# EAGLE design uc_board (EAGLE 6.4)
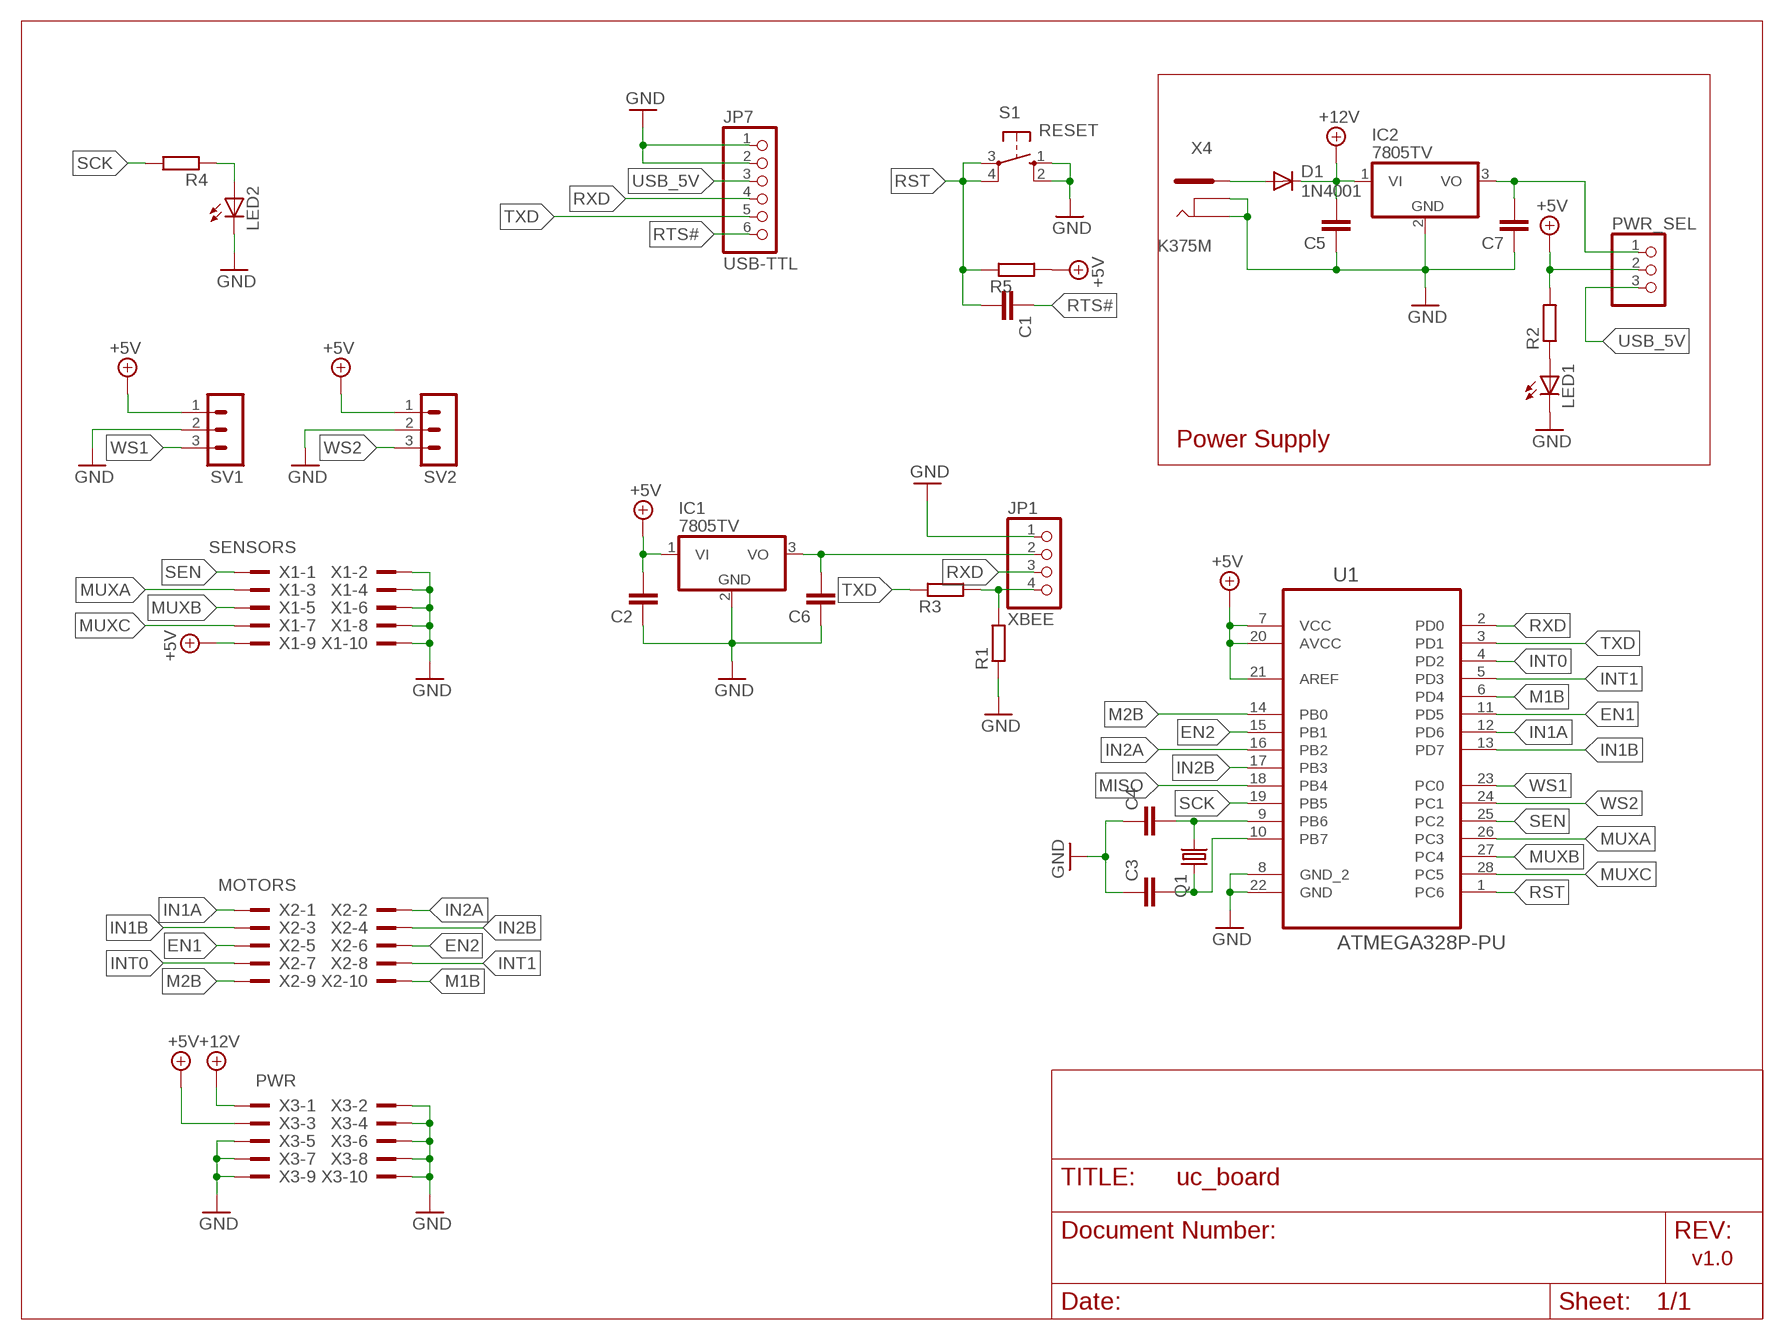
[diagram p0: schematic, sheet 1]

## Parts
C1  C-EU050-025X075  [C050-025X075]
C2  C-EU025-050X050  [C025-050X050]
C3  C-EU050-024X044  [C050-024X044]
C4  C-EU050-024X044  [C050-024X044]
C5  C-EU025-050X050  [C025-050X050]
C6  C-EU025-050X050  [C025-050X050]
C7  C-EU025-050X050  [C025-050X050]
D1  1N4001  1N4004  [DO41-10]
IC1  7805TV  [TO220V]
IC2  7805TV  [TO220V]
JP1  XBEE  PINHD-1X4/90  [1X04/90]
JP7  USB-TTL  PINHD-1X6/90  [1X06/90]
LED1  LED5MM  [LED5MM]
LED2  LED5MM  [LED5MM]
PWR_SEL  PINHD-1X3  [1X03]
Q1  CRYSTALHC49S  [HC49/S]
R1  R-EU_0207/10  [0207/10]
R2  R-EU_0207/10  [0207/10]
R3  R-EU_0207/10  [0207/10]
R4  R-EU_0207/10  [0207/10]
R5  R-EU_0207/10  [0207/10]
S1  RESET  10-XX  [B3F-10XX]
SV1  MA03-1  [MA03-1]
SV2  MA03-1  [MA03-1]
U1  ATMEGA328P-PU  [DIP254P762X457-28]
X1  SENSORS  2510-  [PAK100/2500-10]
X2  MOTORS  2510-  [PAK100/2500-10]
X3  PWR  2510-  [PAK100/2500-10]
X4  K375M  [K375M]

## Nets
+5V: C2.2 IC1.1(VI) PWR_SEL.2 R2.2 R5.2 SV1.1 SV2.1 U1.7(VCC) U1.20(AVCC) U1.21(AREF) X1.9 X3.3
+12V: C5.2 D1.C IC2.1(VI) X3.1
EN1: U1.11(PD5) X2.5
EN2: U1.15(PB1) X2.6
GND: C2.1 C3.1 C4.1 C5.1 C6.1 C7.1 IC1.2(GND) IC2.2(GND) JP1.1 JP7.1 JP7.2 LED1.K(C) LED2.K(C) R1.1 S1.1(S) S1.2(S1) SV1.2 SV2.2 U1.8(GND_2) U1.22(GND) X1.2 X1.4 X1.6 X1.8 X1.10 X3.2 X3.4 X3.5 X3.6 X3.7 X3.8 X3.9 X3.10 X4.2 X4.3
IN1A: U1.12(PD6) X2.1
IN1B: U1.13(PD7) X2.3
IN2A: U1.16(PB2) X2.2
IN2B: U1.17(PB3) X2.4
INT0: U1.4(PD2) X2.7
INT1: U1.5(PD3) X2.8
M1B: U1.6(PD4) X2.10
M2B: U1.14(PB0) X2.9
MISO: U1.18(PB4)
MUXA: U1.26(PC3) X1.3
MUXB: U1.27(PC4) X1.5
MUXC: U1.28(PC5) X1.7
N$1: C4.2 Q1.1 U1.9(PB6)
N$2: C3.2 Q1.2 U1.10(PB7)
N$3: LED1.A R2.1
N$4: LED2.A R4.1
N$5: C6.2 IC1.3(VO) JP1.2
N$6: JP1.4 R1.2 R3.2
N$17: D1.A X4.1
N$22: C7.2 IC2.3(VO) PWR_SEL.1
RST: C1.2 R5.1 S1.3(P) S1.4(P1) U1.1(PC6)
RTS#: C1.1 JP7.6
RXD: JP1.3 JP7.4 U1.2(PD0)
SCK: R4.2 U1.19(PB5)
SEN: U1.25(PC2) X1.1
TXD: JP7.5 R3.1 U1.3(PD1)
USB_5V: JP7.3 PWR_SEL.3
WS1: SV1.3 U1.23(PC0)
WS2: SV2.3 U1.24(PC1)

## Notes on the sheet
- Power Supply
- v1.0

## Library data of the parts
C1-C7 = rcl:C-EU: CAPACITOR, European symbol
D1 = minimidi:1N4004: DIODE general purpose rectifier, 1 A
IC1 IC2 = linear:78*: Positive VOLTAGE REGULATOR Source: http://cache.national.com/ds/LM/LM78L05.pdf http://www.fairchildsemi.com/ds/LM/LM7805.pdf
JP1 = pinhead:PINHD-1X4: PIN HEADER
JP7 = pinhead:PINHD-1X6: PIN HEADER
LED1 LED2 = led:LED: LED OSRAM: - CHIPLED LG R971, LG N971, LY N971, LG Q971, LY Q971, LO R971, LY R971 LH N974, LH R974 LS Q976, LO Q976, LY Q976 LO Q996 - Hyper CHIPLED LW Q18S LB Q993, LB Q99A, LB R99A - SideLED LS A670, LO A670, LY A670, LG A670, LP A670 LB A673, LV A673, LT A673, LW A673 LH A674 LY A675 LS A676, LA A676, LO A676, LY A676, LW A676 LS A679, LY A679, LG A679 - Hyper Micro SIDELED® LS Y876, LA Y876, LO Y876, LY Y876 LT Y87S - SmartLED LW L88C, LW L88S LB L89C, LB L89S, LG L890 LS L89K, LO L89K, LY L89K LS L896, LA L896, LO L896, LY L896 - TOPLED LS T670, LO T670, LY T670, LG T670, LP T670 LSG T670, LSP T670, LSY T670, LOP T670, LYG T670 LG T671, LOG T671, LSG T671 LB T673, LV T673, LT T673, LW T673 LH T674 LS T676, LA T676, LO T676, LY T676, LB T676, LH T676, LSB T676, LW T676 LB T67C, LV T67C, LT T67C, LS T67K, LO T67K, LY T67K, LW E67C LS E67B, LA E67B, LO E67B, LY E67B, LB E67C, LV E67C, LT E67C LW T67C LS T679, LY T679, LG T679 LS T770, LO T770, LY T770, LG T770, LP T770 LB T773, LV T773, LT T773, LW T773 LH T774 LS E675, LA E675, LY E675, LS T675 LS T776, LA T776, LO T776, LY T776, LB T776 LHGB T686 LT T68C, LB T68C - Hyper Mini TOPLED® LB M676 - Mini TOPLED Santana® LG M470 LS M47K, LO M47K, LY M47K Source: http://www.osram.convergy.de LUXEON: - LUMILED® LXK2-PW12-R00, LXK2-PW12-S00, LXK2-PW14-U00, LXK2-PW14-V00 LXK2-PM12-R00, LXK2-PM12-S00, LXK2-PM14-U00 LXK2-PE12-Q00, LXK2-PE12-R00, LXK2-PE12-S00, LXK2-PE14-T00, LXK2-PE14-U00 LXK2-PB12-K00, LXK2-PB12-L00, LXK2-PB12-M00, LXK2-PB14-N00, LXK2-PB14-P00, LXK2-PB14-Q00 LXK2-PR12-L00, LXK2-PR12-M00, LXK2-PR14-Q00, LXK2-PR14-R00 LXK2-PD12-Q00, LXK2-PD12-R00, LXK2-PD12-S00 LXK2-PH12-R00, LXK2-PH12-S00 LXK2-PL12-P00, LXK2-PL12-Q00, LXK2-PL12-R00 Source: www.luxeon.com KINGBRIGHT: KA-3528ASYC Source: www.kingbright.com
PWR_SEL = pinhead:PINHD-1X3: PIN HEADER
Q1 = crystal:CRYSTAL: CRYSTAL; OC_FARNELL: 1667008; OC_NEWARK: unknown
R1-R5 = resistor:R-EU_: RESISTOR, European symbol
S1 = switch-omron:10-XX: OMRON SWITCH; MPN: B3F-1000; OC_FARNELL: 176432; OC_NEWARK: 36M3542
SV1 SV2 = con-lstb:MA03-1: PIN HEADER; OC_FARNELL: unknown; OC_NEWARK: unknown
U1 = atmel2:ATMEGA328P-PU: 8-bit Microcontroller with In-System Programmable Flash; MPN: ATMEGA328P-PU; OC_FARNELL: 1715487; OC_NEWARK: 15R0268; PACKAGE: PDIP-28; SUPPLIER: Atmel
X1-X3 = con-3m:2510-: 3M (TM) Pak 100 4-Wall Header Source: 3M; MF: 3M; MPN: 2510-6002UB; OC_FARNELL: 9838244; OC_NEWARK: 46F4725
X4 = con-shallin:K375M: K375M - DC POWER JACK 2.5mm/CENTRAL PIN Source: Data sheet <http://www.shallin.com/productview.aspx?itemnumber=K375M>

## Board
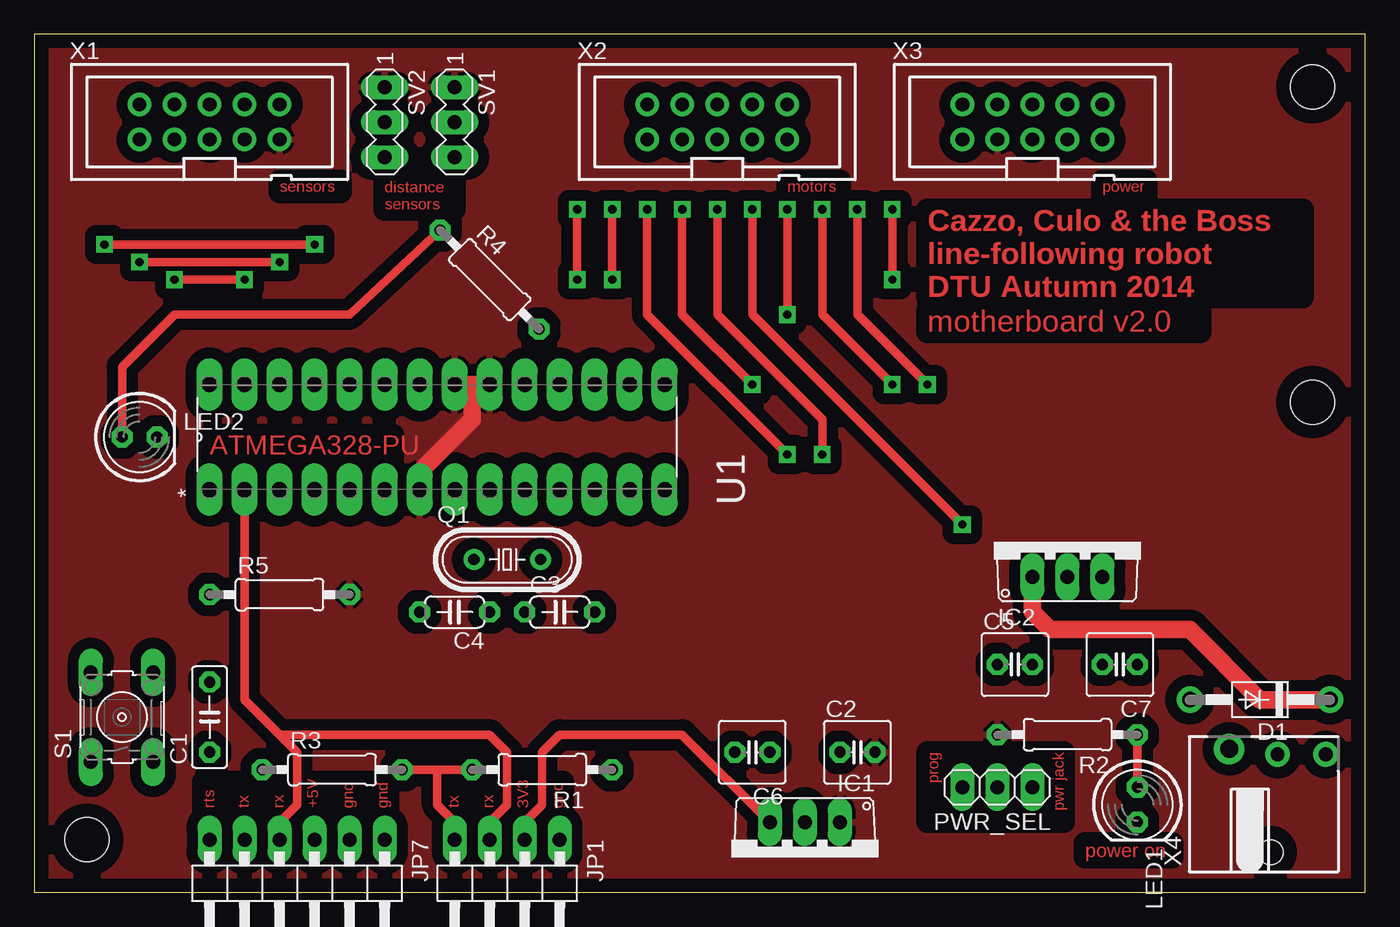
[diagram p1: board, top side]
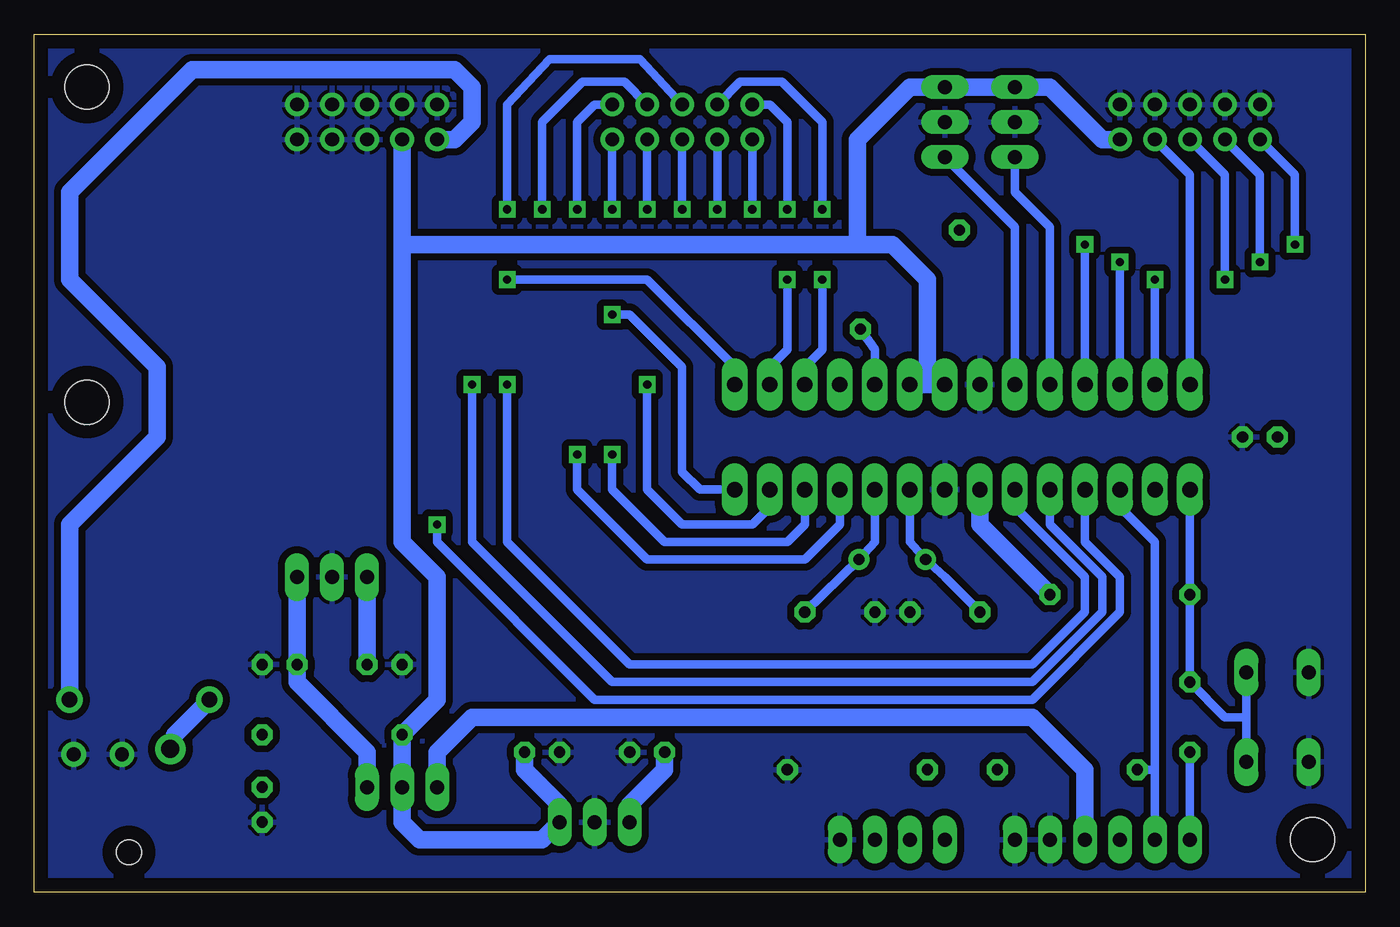
[diagram p2: board, bottom side, seen from below]

Size 96.52 x 62.23 mm. Coordinates in mm from the lower left corner, seen from the top.
Outline: 0,0 96.52,0 96.52,62.23 0,62.23 0,0
Copper layers (1*16): Top 0.035mm / dielectric 1.5mm / Bottom 0.035mm
Design rules "default *": minimum track width 8mil, minimum drill 24mil, track to track 8mil, track to pad 8mil, pad to pad 8mil, via to via 8mil, smd to smd 8mil, copper to edge 40mil, drill to drill 8mil, minimum pad ring 14mil, minimum via ring 12mil, stop-mask expansion 4mil, vias tented up to drill 0mil, thermal gap 10mil
Holes 3.2 mm at 92.71,58.42 3.81,3.81 92.71,35.56

### Footprints (pad centres in the part's own frame; a part is rotated, then mirrored left to right if it is on the bottom)
C050-025X075 = drill 0.813 octagon: 1 -2.54,0; 2 2.54,0
C025-050X050 = drill 0.813 octagon: 1 -1.27,0; 2 1.27,0
C050-024X044 = drill 0.813 octagon: 1 -2.54,0; 2 2.54,0
DO41-10 = drill 1.118 pad 1.93: A 5.08,0; C -5.08,0
TO220V = drill 1.016 long: 1 -2.54,-2.54; 2 0,-2.54; 3 2.54,-2.54
1X04/90 = drill 1.016 long: 1 -3.81,-3.81; 2 -1.27,-3.81; 3 1.27,-3.81; 4 3.81,-3.81
1X06/90 = drill 1.016 long: 1 -6.35,-3.81; 2 -3.81,-3.81; 3 -1.27,-3.81; 4 1.27,-3.81; 5 3.81,-3.81; 6 6.35,-3.81
LED5MM = drill 0.813 octagon: A -1.27,0; K 1.27,0
1X03 = drill 1.016 long: 1 -2.54,0; 2 0,0; 3 2.54,0
HC49/S = drill 0.813: 1 -2.413,0; 2 2.413,0
0207/10 = drill 0.813 octagon: 1 -5.08,0; 2 5.08,0
B3F-10XX = drill 1.016 long: 1 -3.251,2.261; 2 3.251,2.261; 3 -3.251,-2.261; 4 3.251,-2.261
MA03-1 = drill 1.016 long: 1 -2.54,0; 2 0,0; 3 2.54,0
DIP254P762X457-28 = drill 1.118 long: 1 -7.62,33.02; 2 -7.62,30.48; 3 -7.62,27.94; 4 -7.62,25.4; 5 -7.62,22.86; 6 -7.62,20.32; 7 -7.62,17.78; 8 -7.62,15.24; 9 -7.62,12.7; 10 -7.62,10.16; 11 -7.62,7.62; 12 -7.62,5.08; 13 -7.62,2.54; 14 -7.62,0; 15 0,0; 16 0,2.54; 17 0,5.08; 18 0,7.62; 19 0,10.16; 20 0,12.7; 21 0,15.24; 22 0,17.78; 23 0,20.32; 24 0,22.86; 25 0,25.4; 26 0,27.94; 27 0,30.48; 28 0,33.02
PAK100/2500-10 = drill 1 pad 1.422: 1 -5.08,-1.27; 2 -5.08,1.27; 3 -2.54,-1.27; 4 -2.54,1.27; 5 0,-1.27; 6 0,1.27; 7 2.54,-1.27; 8 2.54,1.27; 9 5.08,-1.27; 10 5.08,1.27
K375M = drill 1.3 pad 2.184: 1 -3.5,1.5 | drill 1 pad 1.8: 2 3.5,1.1; 3 0,1.1 | hole 1.8: -0.5,-6

### Placement (x,y rotation side)
C1  12.7,12.7 90 top
C2  59.69,10.16 0 top
C3  38.1,20.32 0 top
C4  30.48,20.32 180 top
C5  71.12,16.51 0 top
C6  52.07,10.16 180 top
C7  78.74,16.51 180 top
D1  88.9,13.97 180 top
IC1  55.88,2.54 180 top
IC2  74.93,25.4 0 top
JP1  34.29,0 180 top
JP7  19.05,0 180 top
LED1  80.01,6.35 270 top
LED2  7.62,33.02 0 top
PWR_SEL  69.85,7.62 180 top
Q1  34.29,24.13 0 top
R1  36.83,8.89 180 top
R2  74.93,11.43 180 top
R3  21.59,8.89 0 top
R4  33.02,44.45 315 top
R5  17.78,21.59 0 top
S1  6.35,12.7 90 top
SV1  30.48,55.88 270 top
SV2  25.4,55.88 270 top
U1  45.72,36.83 90 top
X1  12.7,55.88 0 top
X2  49.53,55.88 0 top
X3  72.39,55.88 0 top
X4  90.17,8.89 0 top

### Tracks (layer width: path | path; a pad name or v marks a point on that pad's centre or on a via)
+5V
  Top 1.27: U1.7 27.94,30.48 31.75,34.29 31.75,36.83 | 31.75,36.83 U1.20 | U1.21 31.75,36.83
  Bottom 1.27: C2.2 60.96,8.89 58.42,6.35 IC1.1 59.69,3.81 68.58,3.81 69.85,5.08 PWR_SEL.2 R2.2 67.31,13.97 67.31,22.86 69.85,25.4 69.85,46.99 | 69.85,46.99 X3.3 | U1.21 31.75,36.83 | 31.75,36.83 U1.20 | 69.85,46.99 36.83,46.99 | 36.83,46.99 34.29,46.99 31.75,44.45 31.75,36.83 | 36.83,46.99 36.83,54.61 33.02,58.42 SV1.1 SV2.1 22.86,58.42 19.05,54.61 X1.9 | U1.7 27.94,26.67 R5.2
  pour Top (isolate 0.813): 0,62.23 96.52,62.23 96.52,0 0,0
+12V
  Top 1.27: IC2.1 72.39,20.32 73.66,19.05 83.82,19.05 88.9,13.97 D1.C
  Bottom 1.27: C5.2 IC2.1 | D1.C 93.98,26.67 87.63,33.02 87.63,38.1 93.98,44.45 93.98,50.8 85.09,59.69 66.04,59.69 64.77,58.42 64.77,55.88 66.04,54.61 X3.1
EN1  (via drill 0.6)
  Top 0.61: v49.53,49.53 49.53,41.91 57.15,34.29 v57.15,31.75
  Bottom 0.61: U1.11 38.1,26.67 40.64,24.13 52.07,24.13 57.15,29.21 v57.15,31.75 | X2.5 v49.53,49.53
EN2  (via drill 0.6)
  Top 0.61: v62.23,44.45 v62.23,49.53
  Bottom 0.61: X2.6 52.6,60.43 59.16,60.43 62.23,57.15 v62.23,49.53 | U1.15 45.72,38.1 52.07,44.45 v62.23,44.45
GND
  pour Bottom (isolate 0.508): 0,62.23 96.52,62.23 96.52,0 0,0
IN1A  (via drill 0.6)
  Top 0.61: v44.45,49.53 44.45,41.91 v54.61,31.75
  Bottom 0.61: U1.12 40.64,26.67 41.91,25.4 50.8,25.4 54.61,29.21 v54.61,31.75 | X2.1 v44.45,49.53
IN1B  (via drill 0.6)
  Top 0.61: v46.99,49.53 46.99,41.91 v52.07,36.83
  Bottom 0.61: U1.13 43.18,27.94 44.45,26.67 49.53,26.67 52.07,29.21 v52.07,36.83 | X2.3 v46.99,49.53
IN2A  (via drill 0.6)
  Top 0.61: v41.91,49.53 v41.91,44.45
  Bottom 0.61: X2.2 43.18,57.15 41.91,55.88 v41.91,49.53 | v41.91,44.45 41.91,39.37 43.18,38.1 U1.16
IN2B  (via drill 0.6)
  Top 0.61: v39.37,44.45 v39.37,49.53
  Bottom 0.61: X2.4 45.35,58.79 42.28,58.79 39.37,55.88 v39.37,49.53 | U1.17 40.64,38.1 39.37,39.37 v39.37,44.45
INT0  (via drill 0.6)
  Top 0.61: v52.07,49.53 52.07,41.91 v67.31,26.67
  Bottom 0.61: U1.4 20.32,25.4 17.78,22.86 17.78,20.32 24.13,13.97 55.88,13.97 67.31,25.4 v67.31,26.67 | X2.7 v52.07,49.53
INT1  (via drill 0.6)
  Top 0.61: v59.69,49.53 59.69,41.91 v64.77,36.83
  Bottom 0.61: U1.5 22.86,26.67 19.05,22.86 19.05,20.32 24.13,15.24 54.61,15.24 64.77,25.4 v64.77,36.83 | X2.8 53.71,58.79 56.78,58.79 59.69,55.88 v59.69,49.53
M1B  (via drill 0.6)
  Top 0.61: v57.15,49.53 57.15,41.91 v62.23,36.83
  Bottom 0.61: U1.6 25.4,27.94 20.32,22.86 20.32,20.32 24.13,16.51 53.34,16.51 62.23,25.4 v62.23,36.83 | X2.10 55.88,57.15 57.15,55.88 v57.15,49.53
M2B  (via drill 0.6)
  Top 0.61: v54.61,49.53 v54.61,41.91
  Bottom 0.61: U1.14 48.26,29.21 49.53,30.48 49.53,38.1 53.34,41.91 v54.61,41.91 | X2.9 v54.61,49.53
MUXA  (via drill 0.6)
  Top 0.61: v17.78,45.72 v7.62,45.72
  Bottom 0.61: X1.3 7.62,52.07 v7.62,45.72 | U1.26 v17.78,45.72
MUXB  (via drill 0.6)
  Top 0.61: v15.24,44.45 v10.16,44.45
  Bottom 0.61: X1.5 10.16,52.07 v10.16,44.45 | U1.27 v15.24,44.45
MUXC
  Bottom 0.61: X1.7 12.7,52.07 U1.28
N$1
  Bottom 0.61: U1.9 33.02,25.4 Q1.1 30.48,22.86 C4.2
N$2
  Bottom 0.61: U1.10 35.56,25.4 Q1.2 C3.2
N$3
  Top 0.61: R2.1 LED1.A
N$4
  Top 0.61: R4.1 22.86,41.91 10.16,41.91 6.35,38.1 LED2.A
N$5
  Top 0.61: JP1.2 35.56,5.08 36.83,6.35 36.83,10.16 38.1,11.43 46.99,11.43 IC1.3
  Bottom 1.27: C6.2 50.8,8.89 53.34,6.35 IC1.3
N$6
  Top 0.61: JP1.4 30.48,5.08 29.21,6.35 29.21,8.89 | 29.21,8.89 R3.2 | 29.21,8.89 R1.2
N$17
  Bottom 1.27: X4.1 86.36,11.43 D1.A
N$22
  Bottom 1.27: PWR_SEL.1 72.39,10.16 77.47,15.24 C7.2 IC2.3
RST
  Bottom 0.61: S1.3 8.61,12.7 | 8.61,12.7 S1.4 | U1.1 R5.1 C1.2 10.16,12.7 8.61,12.7
RTS#
  Bottom 0.61: C1.1 JP7.6
RXD
  Top 0.61: JP1.3 33.02,5.08 34.29,6.35 34.29,10.16 33.02,11.43 17.78,11.43 | JP7.4 17.78,5.08 19.05,6.35 19.05,10.16 17.78,11.43 | 17.78,11.43 15.24,13.97 U1.2
SCK
  Bottom 0.61: U1.19 35.56,39.37 R4.2
SEN  (via drill 0.6)
  Top 0.61: v20.32,46.99 v5.08,46.99
  Bottom 0.61: U1.25 v20.32,46.99 | v5.08,46.99 5.08,52.07 X1.1
TXD
  Bottom 0.61: U1.3 17.78,27.94 15.24,25.4 15.24,8.89 | JP7.5 15.24,8.89 | R3.1 15.24,8.89
USB_5V
  Bottom 1.27: PWR_SEL.3 67.31,10.16 64.77,12.7 24.13,12.7 20.32,8.89 JP7.3
WS1
  Bottom 0.61: SV1.3 25.4,48.26 U1.23
WS2
  Bottom 0.61: U1.24 22.86,48.26 25.4,50.8 SV2.3

### Text on the board
Top: sensors | motors | power | distance / sensors | Cazzo, Culo & the Boss / line-following robot / DTU Autumn 2014 | motherboard v2.0 | ATMEGA328-PU | prog / / / / pwr jack | rts / tx / rx / +5V / gnd / gnd | tx / rx / 3V3 / gnd | power on